# EAGLE design mainV2b (EAGLE 6.6.0)
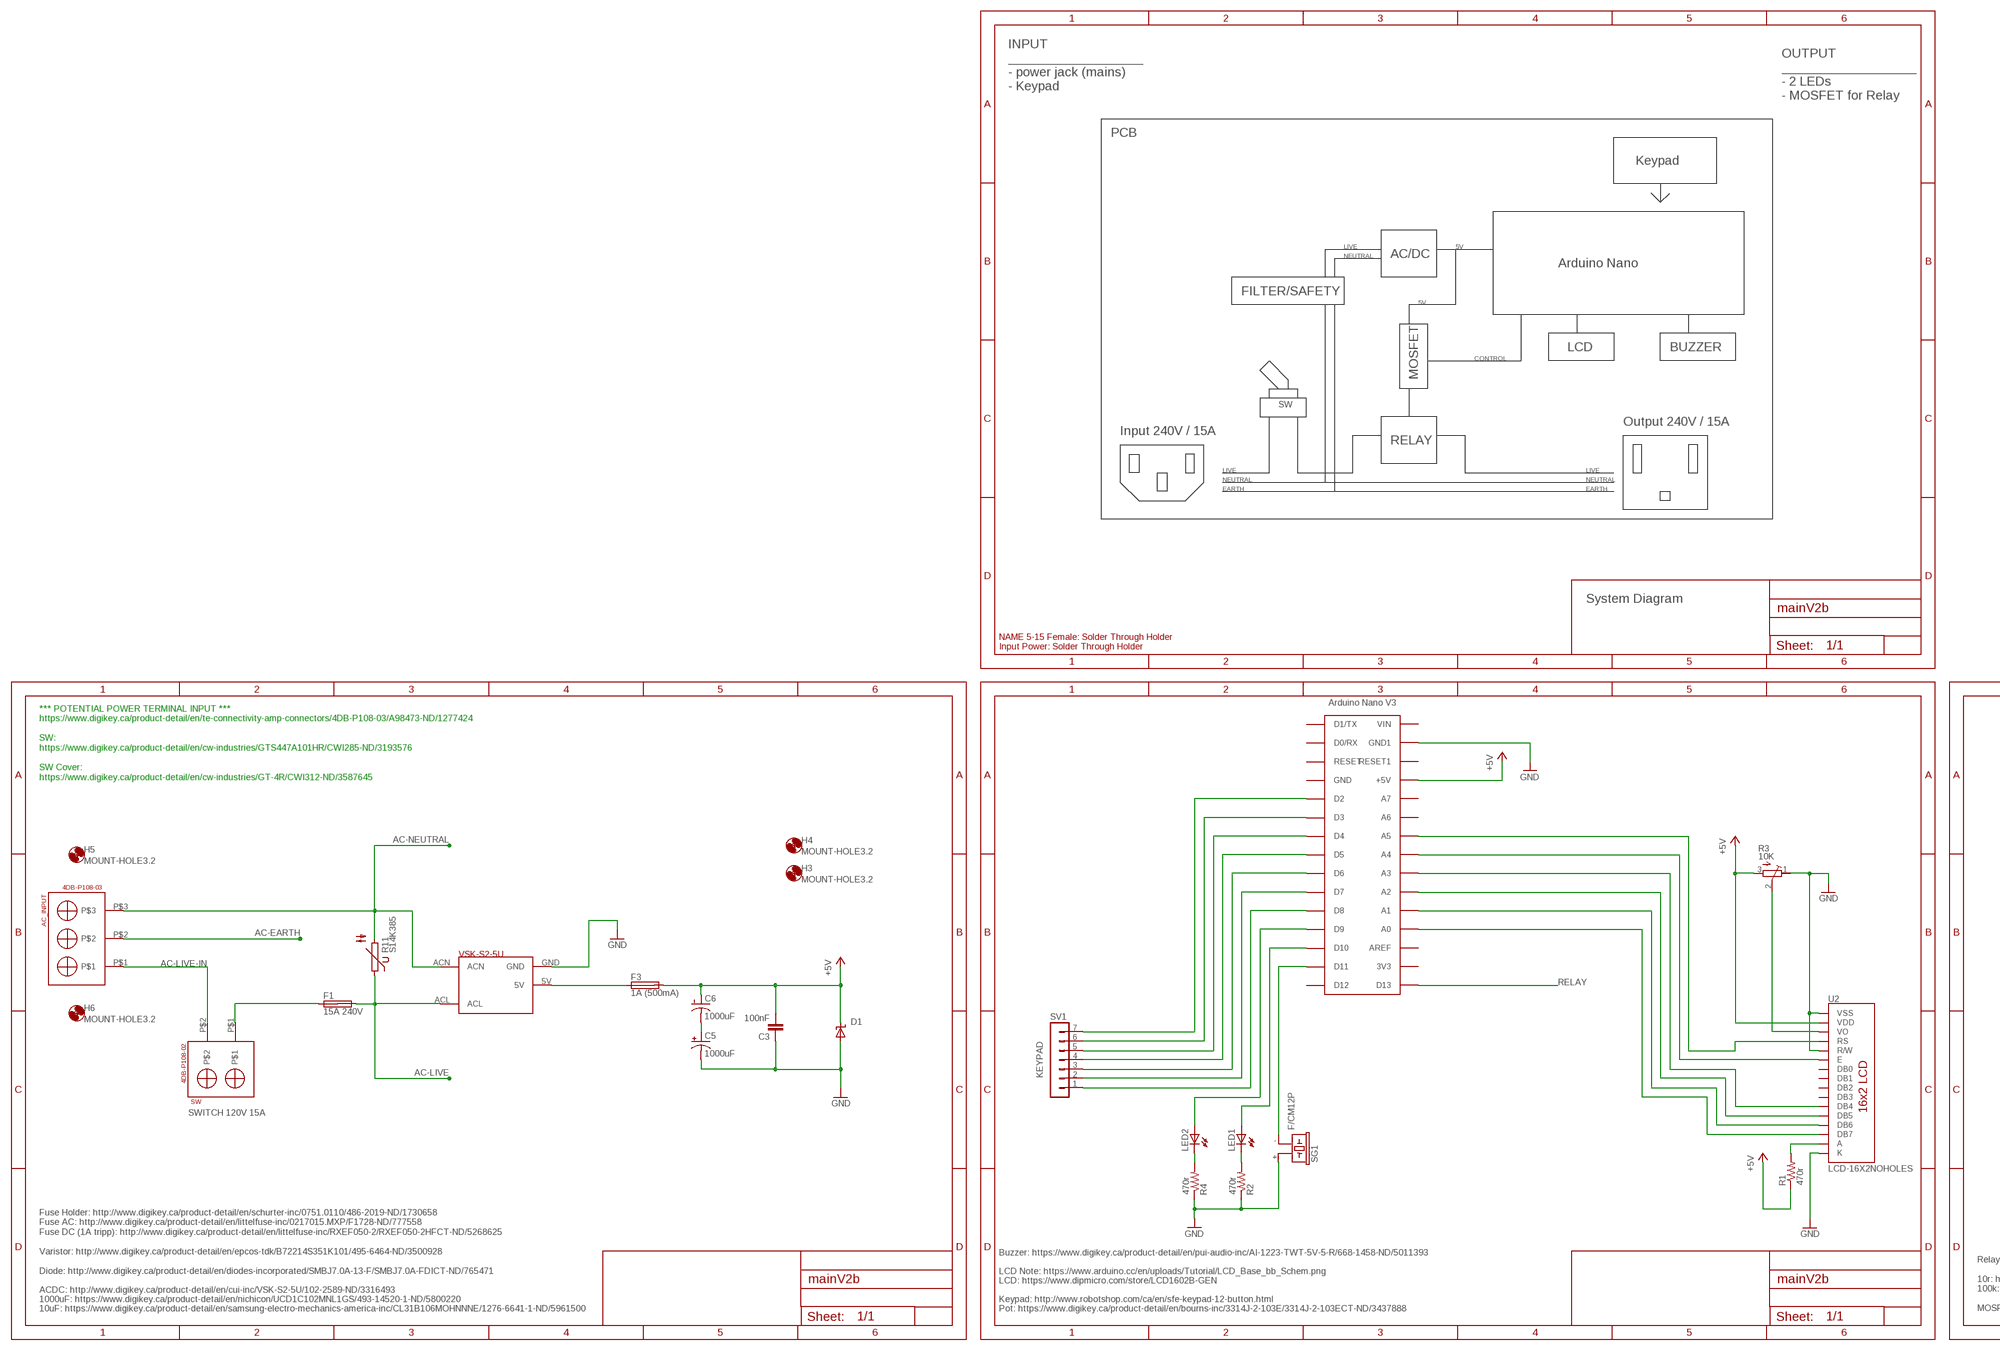
[diagram p0: schematic, sheet 1, part 1 of 2]
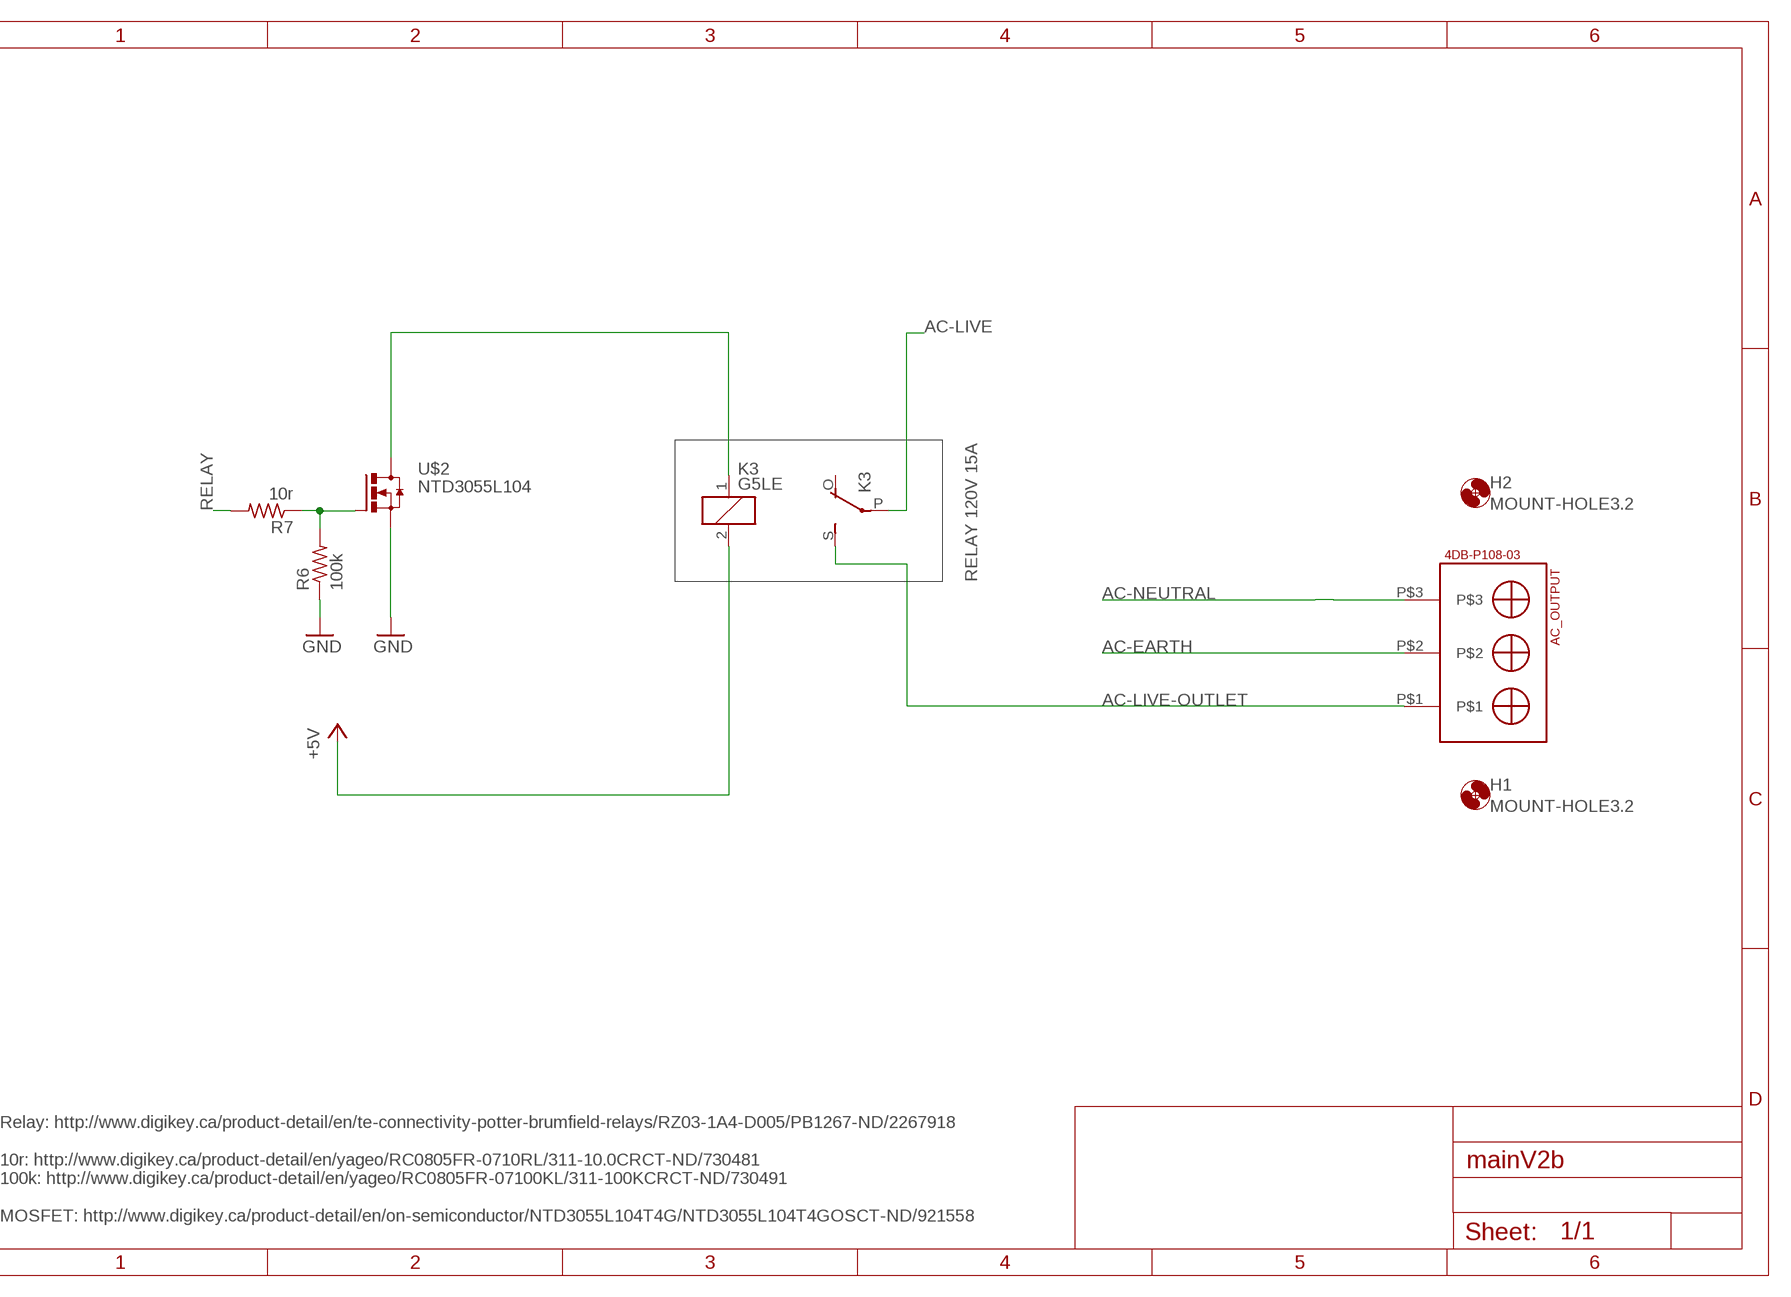
[diagram p1: schematic, sheet 1, part 2 of 2]

## Parts
AC_INPUT  4DB-P108-03  [4DB-P108-03]
AC_OUTPUT  4DB-P108-03  [4DB-P108-03]
C3  100nF  C-EUC1206  [C1206]
C5  1000uF  CPOL-USUD-10X10  [UD-10X10_NICHICON]
C6  1000uF  CPOL-USUD-10X10  [UD-10X10_NICHICON]
D1  SUPPRESSOR-SMBJ  [SMBJ]
F1  15A 240V  SHK20L  [SHK20L]
F3  1A (500mA)  TE5  [TE5]
H1  MOUNT-HOLE3.2  [3,2]
H2  MOUNT-HOLE3.2  [3,2]
H3  MOUNT-HOLE3.2  [3,2]
H4  MOUNT-HOLE3.2  [3,2]
H5  MOUNT-HOLE3.2  [3,2]
H6  MOUNT-HOLE3.2  [3,2]
K3  G5LE  [G5LE]
LED1  LEDCHIPLED_1206  [CHIPLED_1206]
LED2  LEDCHIPLED_1206  [CHIPLED_1206]
R1  470r  R-US_M2012  [M2012]
R2  470r  R-US_M2012  [M2012]
R3  10K  R-TRIMM3314G  [RTRIM3314G]
R4  470r  R-US_M2012  [M2012]
R6  100k  R-US_M2012  [M2012]
R7  10r  R-US_M2012  [M2012]
R11  S14K385  [S14K385]
SG1  F/CM12P  [F/CM12P]
SV1  MA07-1  [MA07-1]
SW  4DB-P108-02  [4DB-P108-02]
U2  LCD-16X2NOHOLES  [LCD-16X2_NOHOLESNOSILK]
U$1  ARDUINONANO  [PDIP-32]
U$2  NTD3055L104  [NTDV3055L104]
U$4  VSK-2S-5U  [VSK-S2-5U]

## Nets
+5V: C3.2 C6.+ D1.C F3.2 K3.2 R1.1 R3.3(A) U2.2(VDD) U$1.+5V
AC-EARTH: AC_INPUT.P$2 AC_OUTPUT.P$2
AC-LIVE: F1.2A K3.P(2:P) R11.1 U$4.ACL
AC-LIVE-IN: AC_INPUT.P$1 SW.P$2
AC-LIVE-OUTLET: AC_OUTPUT.P$1 K3.S(2:S)
AC-NEUTRAL: AC_INPUT.P$3 AC_OUTPUT.P$3 R11.2 U$4.ACN
GND: C3.1 C5.- D1.A R2.1 R3.1(E) R4.1 R6.1 SG1.+ U2.1(VSS) U2.5(R/W) U2.16(K) U$1.GND1 U$2.3(S) U$4.GND
N$1: U2.4(RS) U$1.A2(A5)
N$2: U2.6(E) U$1.A3(A4)
N$3: U2.11(DB4) U$1.A4(A3)
N$4: U2.12(DB5) U$1.A5(A2)
N$5: U2.13(DB6) U$1.A6(A1)
N$6: R6.2 R7.1 U$2.1(G)
N$7: U2.14(DB7) U$1.A7(A0)
N$8: K3.1 U$2.4(D)
N$9: R3.2(S) U2.3(VO)
N$10: R1.2 U2.15(A)
N$12: F1.1A SW.P$1
N$16: SV1.1 U$1.D8
N$17: SV1.2 U$1.D7
N$18: SV1.3 U$1.D6
N$19: SV1.4 U$1.D5
N$20: SV1.5 U$1.D4
N$21: C5.+ C6.-
N$22: F3.1 U$4.5V
N$23: SV1.6 U$1.D3
N$24: SV1.7 U$1.D2
N$26: LED1.C R2.2
N$27: LED2.C R4.2
N$28: LED2.A U$1.D9
N$29: LED1.A U$1.D10
N$30: SG1.- U$1.D11
RELAY: R7.2 U$1.D13
Unconnected: F1.1B F1.2B K3.O(2:O) U2.7(DB0) U2.8(DB1) U2.9(DB2) U2.10(DB3) U$1.3V3 U$1.A0(A7) U$1.A1(A6) U$1.AREF U$1.D0/RX U$1.D1/TX U$1.D12 U$1.GND U$1.RESET U$1.RESET1 U$1.VIN

## Notes on the sheet
- INPUT
  __________________
  - power jack (mains)
  - Keypad
- OUTPUT
  __________________
  - 2 LEDs
  - MOSFET for Relay
- PCB
- Keypad
- LIVE | 5V
- NEUTRAL | AC/DC
- Arduino Nano
- FILTER/SAFETY
- 5V
- LCD | BUZZER
- CONTROL
- MOSFET
- SW
- Output 240V / 15A
- Input 240V / 15A
- RELAY
- LIVE | LIVE
- NEUTRAL | NEUTRAL
- EARTH | EARTH
- System Diagram
- NAME 5-15 Female: Solder Through Holder
  Input Power: Solder Through Holder
- *** POTENTIAL POWER TERMINAL INPUT ***
  https://www.digikey.ca/product-detail/en/te-connectivity-amp-connectors/4DB-P108-03/A98473-ND/1277424
  
  SW:
  https://www.digikey.ca/product-detail/en/cw-industries/GTS447A101HR/CWI285-ND/3193576
  
  SW Cover:
  https://www.digikey.ca/product-detail/en/cw-industries/GT-4R/CWI312-ND/3587645
- RELAY 120V 15A
- KEYPAD
- SWITCH 120V 15A
- Buzzer: https://www.digikey.ca/product-detail/en/pui-audio-inc/AI-1223-TWT-5V-5-R/668-1458-ND/5011393
- Fuse Holder: http://www.digikey.ca/product-detail/en/schurter-inc/0751.0110/486-2019-ND/1730658
  Fuse AC: http://www.digikey.ca/product-detail/en/littelfuse-inc/0217015.MXP/F1728-ND/777558
  Fuse DC (1A tripp): http://www.digikey.ca/product-detail/en/littelfuse-inc/RXEF050-2/RXEF050-2HFCT-ND/5268625
  
  Varistor: http://www.digikey.ca/product-detail/en/epcos-tdk/B72214S351K101/495-6464-ND/3500928
  
  Diode: http://www.digikey.ca/product-detail/en/diodes-incorporated/SMBJ7.0A-13-F/SMBJ7.0A-FDICT-ND/765471
- LCD Note: https://www.arduino.cc/en/uploads/Tutorial/LCD_Base_bb_Schem.png
- LCD: https://www.dipmicro.com/store/LCD1602B-GEN
- ACDC: http://www.digikey.ca/product-detail/en/cui-inc/VSK-S2-5U/102-2589-ND/3316493
- 1000uF: https://www.digikey.ca/product-detail/en/nichicon/UCD1C102MNL1GS/493-14520-1-ND/5800220 | Keypad: http://www.robotshop.com/ca/en/sfe-keypad-12-button.html
- 10uF: https://www.digikey.ca/product-detail/en/samsung-electro-mechanics-america-inc/CL31B106MOHNNNE/1276-6641-1-ND/5961500 | Pot: https://www.digikey.ca/product-detail/en/bourns-inc/3314J-2-103E/3314J-2-103ECT-ND/3437888
- Relay: http://www.digikey.ca/product-detail/en/te-connectivity-potter-brumfield-relays/RZ03-1A4-D005/PB1267-ND/2267918
  
  10r: http://www.digikey.ca/product-detail/en/yageo/RC0805FR-0710RL/311-10.0CRCT-ND/730481
  100k: http://www.digikey.ca/product-detail/en/yageo/RC0805FR-07100KL/311-100KCRCT-ND/730491
  
  MOSFET: http://www.digikey.ca/product-detail/en/on-semiconductor/NTD3055L104T4G/NTD3055L104T4GOSCT-ND/921558

## Library data of the parts
AC_INPUT AC_OUTPUT = outletControl:4DB-P108-03
C3 = rcl:C-EU: CAPACITOR, European symbol
C5 C6 = rcl:CPOL-US: POLARIZED CAPACITOR, American symbol
D1 = diode:SUPPRESSOR-: Suppressor diode
F1 = fuse:SHK20L: FUSE HOLDER 5 x 20 mm, SH contact, SHH1 Schukat, E1073 Buerklin; OC_FARNELL: unknown; OC_NEWARK: unknown
F3 = fuse:TE5: FUSE Wickmann; OC_FARNELL: unknown; OC_NEWARK: unknown
H1-H6 = holes:MOUNT-HOLE: MOUNTING HOLE with drill center marker
K3 = relay:G5LE: RELAY 1 x switch, 10 A/120 V AC, 8 A/30 V DC, Omron; OC_FARNELL: unknown; OC_NEWARK: unknown
LED1 LED2 = led:LED: LED OSRAM: - CHIPLED LG R971, LG N971, LY N971, LG Q971, LY Q971, LO R971, LY R971 LH N974, LH R974 LS Q976, LO Q976, LY Q976 LO Q996 - Hyper CHIPLED LW Q18S LB Q993, LB Q99A, LB R99A - SideLED LS A670, LO A670, LY A670, LG A670, LP A670 LB A673, LV A673, LT A673, LW A673 LH A674 LY A675 LS A676, LA A676, LO A676, LY A676, LW A676 LS A679, LY A679, LG A679 - Hyper Micro SIDELED® LS Y876, LA Y876, LO Y876, LY Y876 LT Y87S - SmartLED LW L88C, LW L88S LB L89C, LB L89S, LG L890 LS L89K, LO L89K, LY L89K LS L896, LA L896, LO L896, LY L896 - TOPLED LS T670, LO T670, LY T670, LG T670, LP T670 LSG T670, LSP T670, LSY T670, LOP T670, LYG T670 LG T671, LOG T671, LSG T671 LB T673, LV T673, LT T673, LW T673 LH T674 LS T676, LA T676, LO T676, LY T676, LB T676, LH T676, LSB T676, LW T676 LB T67C, LV T67C, LT T67C, LS T67K, LO T67K, LY T67K, LW E67C LS E67B, LA E67B, LO E67B, LY E67B, LB E67C, LV E67C, LT E67C LW T67C LS T679, LY T679, LG T679 LS T770, LO T770, LY T770, LG T770, LP T770 LB T773, LV T773, LT T773, LW T773 LH T774 LS E675, LA E675, LY E675, LS T675 LS T776, LA T776, LO T776, LY T776, LB T776 LHGB T686 LT T68C, LB T68C - Hyper Mini TOPLED® LB M676 - Mini TOPLED Santana® LG M470 LS M47K, LO M47K, LY M47K Source: http://www.osram.convergy.de LUXEON: - LUMILED® LXK2-PW12-R00, LXK2-PW12-S00, LXK2-PW14-U00, LXK2-PW14-V00 LXK2-PM12-R00, LXK2-PM12-S00, LXK2-PM14-U00 LXK2-PE12-Q00, LXK2-PE12-R00, LXK2-PE12-S00, LXK2-PE14-T00, LXK2-PE14-U00 LXK2-PB12-K00, LXK2-PB12-L00, LXK2-PB12-M00, LXK2-PB14-N00, LXK2-PB14-P00, LXK2-PB14-Q00 LXK2-PR12-L00, LXK2-PR12-M00, LXK2-PR14-Q00, LXK2-PR14-R00 LXK2-PD12-Q00, LXK2-PD12-R00, LXK2-PD12-S00 LXK2-PH12-R00, LXK2-PH12-S00 LXK2-PL12-P00, LXK2-PL12-Q00, LXK2-PL12-R00 Source: www.luxeon.com KINGBRIGHT: KA-3528ASYC Source: www.kingbright.com
R1 R2 R4 R6 R7 = rcl:R-US_: RESISTOR, American symbol
R3 = resistor:R-TRIMM: Trimm resistor
R11 = varistor:S14K385: VARISTOR
SG1 = buzzer:F/CM12P: BUZZER Source: Buerklin; OC_FARNELL: unknown; OC_NEWARK: unknown
SV1 = con-lstb:MA07-1: PIN HEADER; OC_FARNELL: unknown; OC_NEWARK: unknown
SW = outletControl:4DB-P108-02
U2 = SparkFun-Displays:LCD-16X2: Standard text-only 16x2 parallel input LCD Basic 16 character by 2 line display. Typically utilizes the extremely common HD44780 parallel interface chipset SparkFun Products: Basic 16x2 Green <https://www.sparkfun.com/products/255> Basic 8x2 Green <https://www.sparkfun.com/products/11122>; SF_ID: LCD-00255
U$1 = CRE-Lib1:ARDUINONANO: Arduino Nano
U$2 = Smartiphy:NTD3055L104
U$4 = lletek:VSK-2S-5U

## Net classes
0 default: width 0.178 mm, drill 0.381 mm, clearance 0.178 mm

## Board
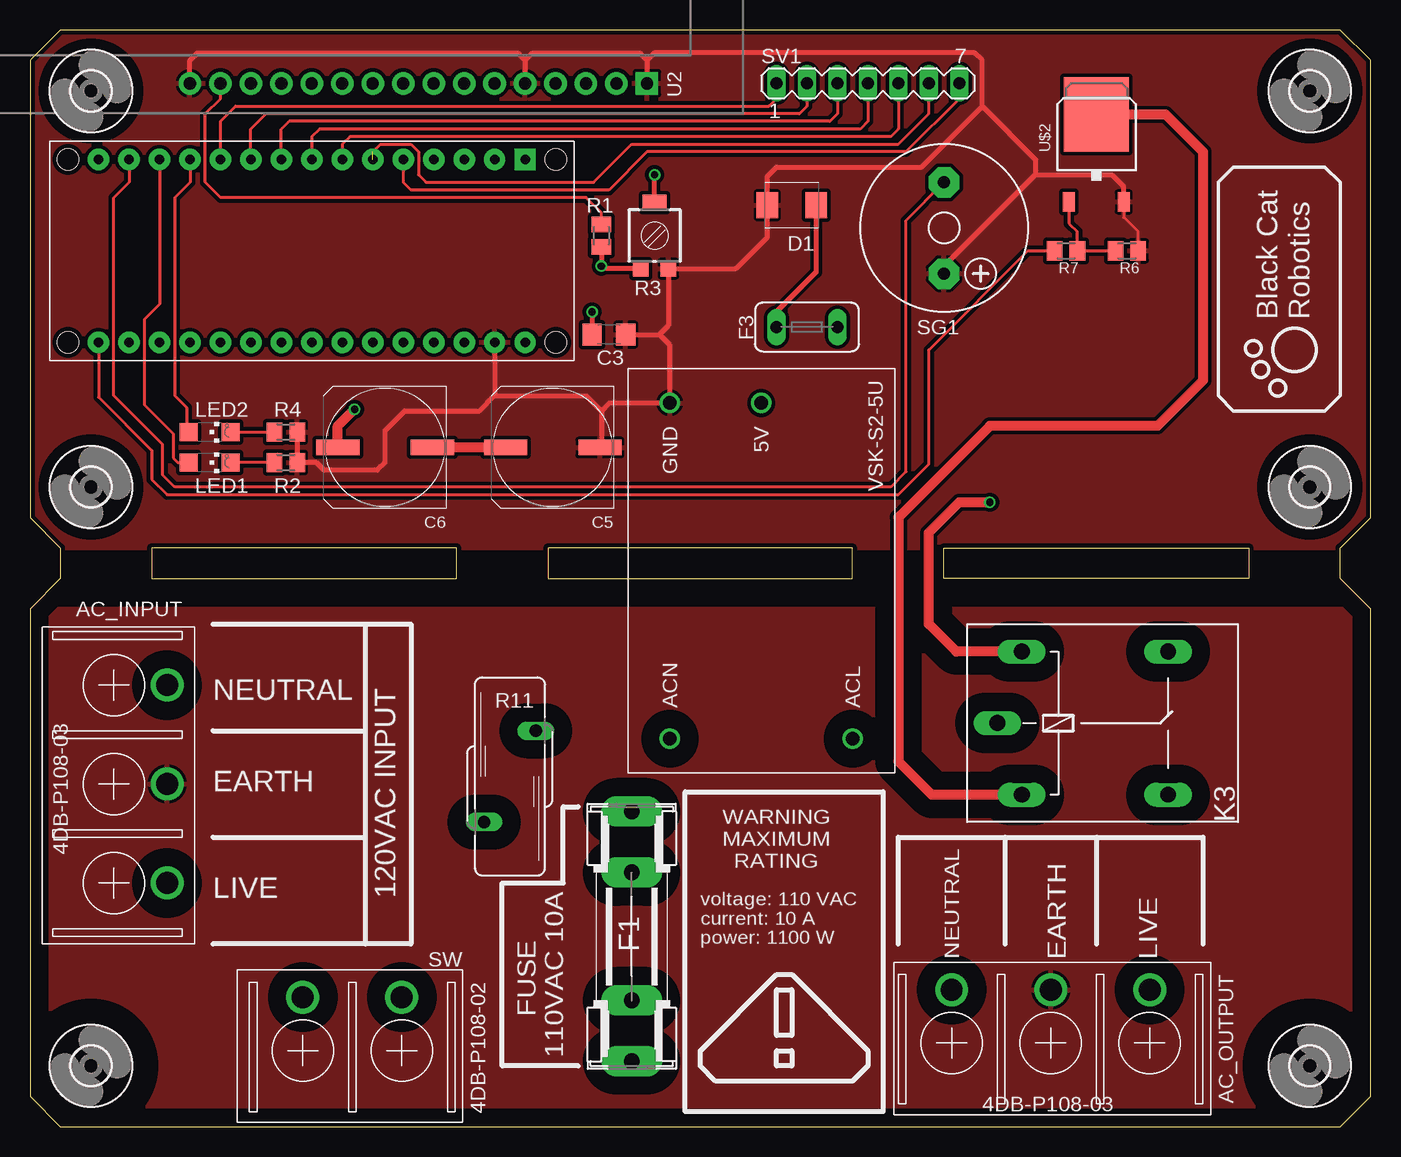
[diagram p2: board, top side]
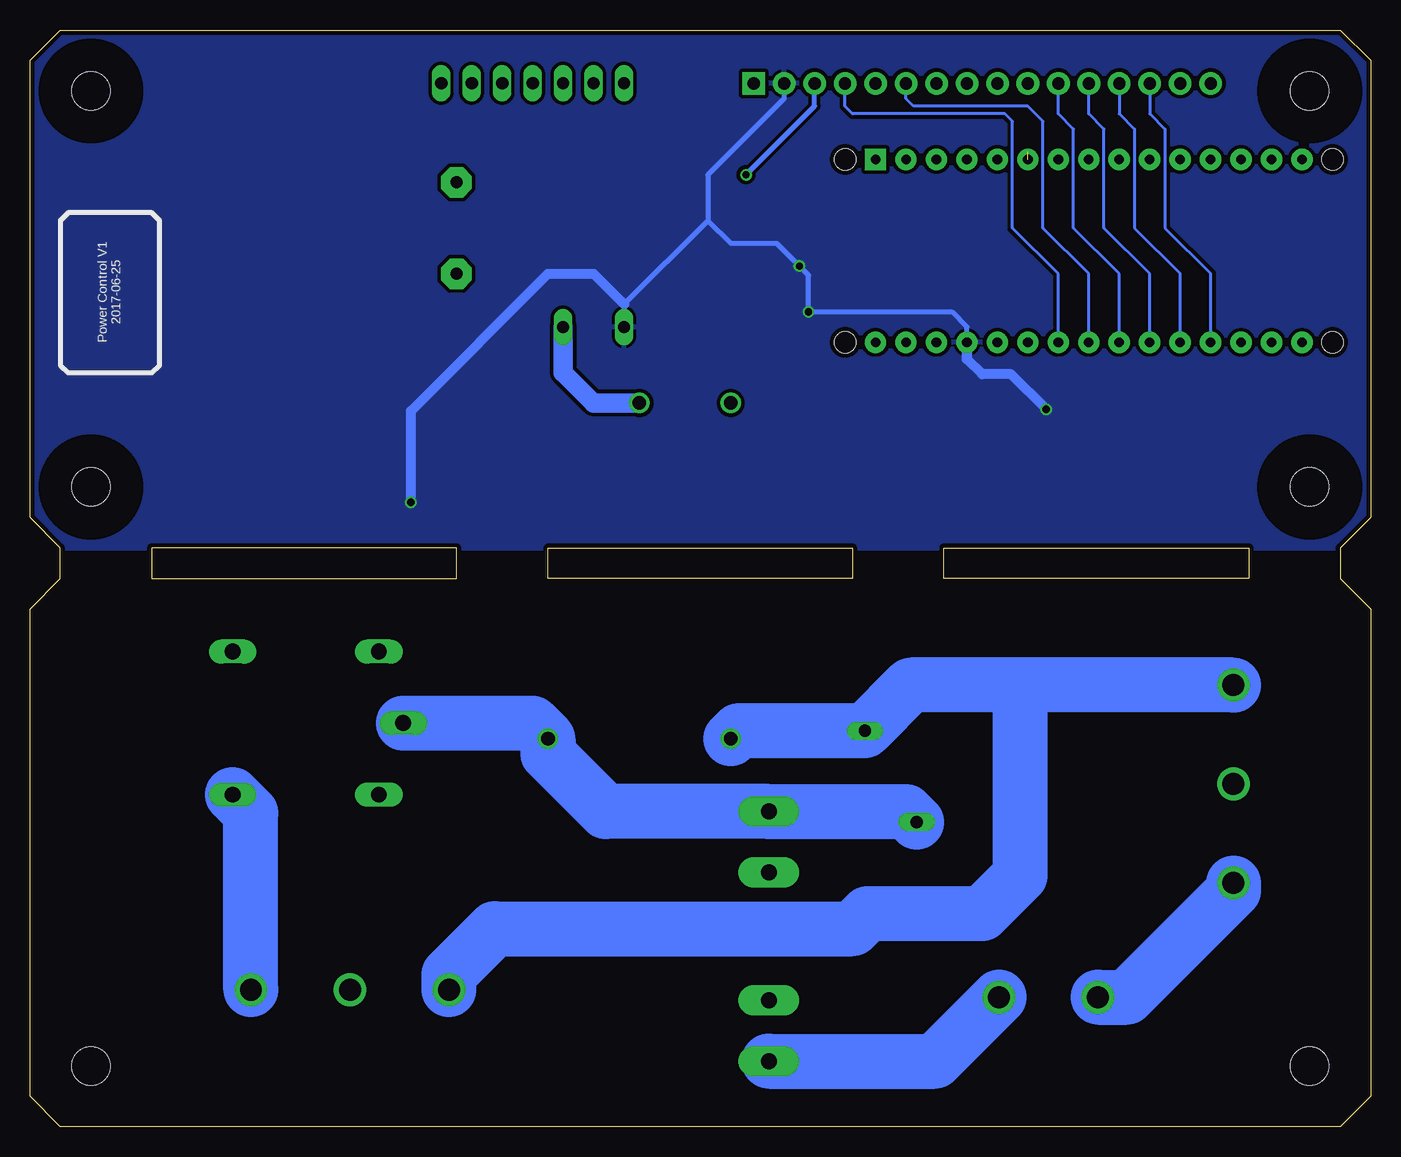
[diagram p3: board, bottom side, seen from below]

Size 111.76 x 91.44 mm. Coordinates in mm from the lower left corner, seen from the top.
Outline: 2.54,0 109.22,0 111.76,2.54 111.76,43.18 109.22,45.72 109.22,48.26 111.76,50.8 111.76,88.9 109.22,91.44 2.54,91.44 0,88.9 0,50.8 2.54,48.26 2.54,45.72 0,43.18 0,2.54 2.54,0
Outline: 10.16,48.26 10.16,45.72 35.56,45.72 35.56,48.26 10.16,48.26
Outline: 43.18,48.26 43.18,45.72 68.58,45.72 68.58,48.26 43.18,48.26
Outline: 101.6,48.26 101.6,45.72 76.2,45.72 76.2,48.26 101.6,48.26
Copper layers (1*16): Top 0.0356mm / dielectric 1.5011mm / Bottom 0.0356mm
Design rules "OSHpark": minimum track width 6mil, minimum drill 13mil, track to track 6mil, track to pad 6mil, pad to pad 6mil, via to via 6mil, smd to smd 6mil, copper to edge 15mil, drill to drill 6mil, minimum pad ring 7mil, minimum via ring 7mil, stop-mask expansion 3mil, vias tented up to drill 0mil, thermal gap 10mil

### Footprints (pad centres in the part's own frame; a part is rotated, then mirrored left to right if it is on the bottom)
4DB-P108-03 = drill 1.829: P$1 0,0; P$2 8.255,0; P$3 16.51,0
C1206 = smd 1.6 x 1.8: 1 -1.4,0; 2 1.4,0
UD-10X10_NICHICON = smd 3.6 x 1.3: + 3.925,0; - -3.95,0
SMBJ = smd 1.78 x 2.16: A 2.04,0; C -2.03,0
SHK20L = drill 1.321 pad 2.54 long: 1A -10.414,0; 1B -5.334,0; 2A 10.414,0; 2B 5.334,0
TE5 = drill 1.016 long: 1 -2.54,0; 2 2.54,0
3,2 = hole 3.2: 0,0
G5LE = drill 1.321 long: 1 -7.493,-5.969; 2 -7.493,5.969; O 4.699,5.969; P -9.525,0; S 4.699,-5.969
CHIPLED_1206 = smd 1.5 x 1.5: A 0,-1.75; C 0,1.75
M2012 = smd 1.3 x 1.6: 1 -0.95,0; 2 0.95,0
RTRIM3314G = smd 1.3 x 1.3: 1 1.15,-2.75; 3 -1.15,-2.75 | smd 2 x 1.3: 2 0,2.75
S14K385 = drill 1.016 long: 1 -2.159,-3.81; 2 2.159,3.81
F/CM12P = drill 1.016 pad 2.54 octagon: + 3.81,0; - -3.81,0
MA07-1 = drill 1.016 long: 1 -7.62,0; 2 -5.08,0; 3 -2.54,0; 4 0,0; 5 2.54,0; 6 5.08,0; 7 7.62,0
4DB-P108-02 = drill 1.829: P$1 -7.62,-5.08; P$2 0.635,-5.08
LCD-16X2_NOHOLESNOSILK = drill 1.016 pad 1.88 square: 1 -32,15.5 | drill 1.016 pad 1.88: 2 -29.46,15.5; 3 -26.92,15.5; 4 -24.38,15.5; 5 -21.84,15.5; 6 -19.3,15.5; 7 -16.76,15.5; 8 -14.22,15.5; 9 -11.68,15.5; 10 -9.14,15.5; 11 -6.6,15.5; 12 -4.06,15.5; 13 -1.52,15.5; 14 1.02,15.5; 15 3.56,15.5; 16 6.1,15.5
PDIP-32 = drill 0.8 pad 1.778: 3V3 15.24,-35.56; +5V 15.24,-10.16; A0 15.24,-12.7; A1 15.24,-15.24; A2 15.24,-17.78; A3 15.24,-20.32; A4 15.24,-22.86; A5 15.24,-25.4; A6 15.24,-27.94; A7 15.24,-30.48; AREF 15.24,-33.02; D0/RX 0,-5.08; D2 0,-12.7; D3 0,-15.24; D4 0,-17.78; D5 0,-20.32; D6 0,-22.86; D7 0,-25.4; D8 0,-27.94; D9 0,-30.48; D10 0,-33.02; D11 0,-35.56; D12 0,-38.1; D13 15.24,-38.1; GND 0,-10.16; GND1 15.24,-5.08; RESET 0,-7.62; RESET1 15.24,-7.62; VIN 15.24,-2.54 | drill 0.8 pad 1.778 square: D1/TX 0,-2.54 | hole 1.778: 0,0; 0,-40.64; 15.24,-40.64; 15.24,0
NTDV3055L104 = smd 1 x 1.6: 1 -2.28,-6.07; 3 2.28,-6.07 | smd 5.4 x 6.2: 4 0,1.23
VSK-S2-5U = drill 1.143: 5V 13.995,0; ACL -13.995,-7.62; ACN -13.995,7.62; GND 13.995,7.62

### Placement (x,y rotation side)
AC_INPUT  11.43,20.32 90 top
AC_OUTPUT  93.34,11.43 180 top
C3  48.26,66.04 180 top
C5  43.56,56.64 180 top
C6  29.59,56.64 180 top
D1  63.5,76.83 180 top
F1  50.16,15.88 90 top
F3  64.77,66.67 180 top
H1  5.08,86.36 0 top
H2  106.68,5.08 0 top
H3  106.68,86.36 0 top
H4  5.08,5.08 0 top
H5  5.08,53.34 0 top
H6  106.68,53.34 0 top
K3  90.17,33.66 0 top
LED1  14.99,55.37 270 top
LED2  14.99,57.91 270 top
R1  47.62,74.3 90 top
R2  21.34,55.37 180 top
R3  52.07,74.3 0 top
R4  21.34,57.91 180 top
R6  91.44,73.03 180 top
R7  86.36,73.03 180 top
R11  40.01,29.21 0 top
SG1  76.2,74.93 270 top
SV1  69.85,87 0 top
SW  23.37,5.71 180 top
U2  19.43,102.49 180 top
U$1  43.81,80.64 270 top
U$2  88.9,83.19 0 top
U$4  60.96,46.35 90 top

### Tracks (layer width: path | path; a pad name or v marks a point on that pad's centre or on a via)
+5V  (via drill 0.6)
  Top 0.406: R1.1 v47.62,71.75 47.84,71.55 R3.3 | D1.C 65.53,71.25 62.23,67.94 F3.2 | v46.86,67.94 C3.2
  Top 0.813: C6.+ 25.67,58.43 v27.05,59.82 | K3.2 77.22,39.62 74.93,41.91 74.93,49.53 77.47,52.07 v80.01,52.07
  Bottom 0.406: U2.2 48.89,85.73 55.24,79.38 55.24,75.56 | 55.24,75.56 53.34,73.66 49.53,73.66 v47.62,71.75 46.86,70.99 v46.86,67.94 34.92,67.94 33.66,66.67 U$1.+5V | 55.24,75.56 62.23,68.58 F3.2
  Bottom 0.813: v27.05,59.82 29.97,62.74 32.38,62.74 33.66,64.01 | v80.01,52.07 80.01,59.69 68.58,71.12 64.77,71.12 62.23,68.58
  Bottom 0.864: 33.66,64.01 U$1.+5V
  pour Bottom (isolate 0.305): 0,50.8 0,88.9 2.54,91.44 109.22,91.44 111.76,88.9 111.76,50.8 109.22,48.26 2.54,48.26
AC-EARTH
  pour Top (isolate 1.524): 0,43.18 111.76,43.18 111.76,2.54 109.22,0 2.54,0 0,2.54
AC-LIVE
  Bottom 4.572: R11.1 38.73,26.29 F1.2A 63.78,26.29 68.58,31.09 U$4.ACL 69.88,33.66 K3.P
AC-LIVE-IN
  Bottom 4.572: AC_INPUT.P$1 11.43,19.68 20.32,10.79 SW.P$2
AC-LIVE-OUTLET
  Bottom 4.572: AC_OUTPUT.P$1 93.34,26.16 K3.S
AC-NEUTRAL
  Bottom 4.572: AC_INPUT.P$3 29.21,36.83 | 29.21,36.83 38.35,36.83 R11.2 52.68,33.02 U$4.ACN | 29.21,36.83 29.21,20.95 32.38,17.78 41.91,17.78 43.18,16.51 73.03,16.51 76.83,12.7 AC_OUTPUT.P$3
GND
  Top 0.254: U$2.3 91.18,75.83 92.39,74.61 R6.1
  Top 0.406: U2.16 13.33,88.9 13.97,89.53 40.64,89.53 41.27,88.9 U2.5 41.27,88.9 41.91,89.53 50.8,89.53 51.44,88.9 | 51.44,88.9 U2.1 | SG1.+ 76.2,71.75 83.82,79.38 | 83.82,79.38 90.17,79.38 91.18,78.36 U$2.3 | R4.1 R2.1 23.88,55.37 24.51,54.74 28.96,54.74 29.59,55.37 29.59,58.04 31.24,59.69 37.47,59.69 38.73,60.96 | 79.38,85.09 74.3,80.01 62.23,80.01 61.46,79.24 D1.A 61.46,74.16 58.84,71.55 R3.1 53.22,66.8 52.47,66.04 | 79.38,85.09 79.38,88.9 78.74,89.53 52.07,89.53 51.44,88.9 | 79.38,85.09 83.82,80.64 83.82,79.38 | 47.62,59.69 48.28,60.35 U$4.GND 53.34,65.17 52.47,66.04 | 47.62,59.69 47.62,56.76 C5.- | 38.73,60.96 46.35,60.96 47.62,59.69 | C3.1 52.47,66.04 | U$1.GND1 38.73,60.96
  pour Top (isolate 0.305): 0,88.9 2.54,91.44 109.22,91.44 111.76,88.9 111.76,50.8 109.22,48.26 2.54,48.26 0,50.8
N$1
  Bottom 0.254: U2.4 43.81,85.09 43.18,84.45 30.48,84.45 29.84,83.82 29.84,74.93 26.04,71.12 U$1.A2
N$2
  Bottom 0.254: U2.6 38.73,85.72 38.1,85.09 28.57,85.09 27.3,83.82 27.3,74.93 23.5,71.12 U$1.A3
N$3
  Bottom 0.254: U2.11 26.04,84.45 24.77,83.19 24.77,74.93 20.95,71.12 U$1.A4
N$4
  Bottom 0.254: U2.12 23.5,84.45 22.23,83.19 22.23,74.93 18.41,71.12 U$1.A5
N$5
  Bottom 0.254: U2.13 20.95,84.45 19.68,83.19 19.68,74.93 15.88,71.12 U$1.A6
N$6
  Top 0.254: R6.2 R7.1 87.31,74.61 86.62,75.31 U$2.1
N$7
  Bottom 0.254: U2.14 18.41,84.45 17.14,83.19 17.14,74.93 13.34,71.12 U$1.A7
N$8
  Top 0.813: U$2.4 94.66,84.42 97.79,81.28 97.79,62.23 93.98,58.42 80.01,58.42 72.39,50.8 72.39,30.48 75.18,27.69 K3.1
N$9  (via drill 0.6)
  Top 0.406: R3.2 v52.07,79.38
  Bottom 0.406: v52.07,79.38 46.35,85.09 U2.3
N$10
  Top 0.254: R1.2 47.62,76.2 46.35,77.47 15.88,77.47 14.61,78.74 14.61,84.45 15.88,85.72 U2.15
N$12
  Bottom 4.572: F1.1A 36.32,5.46 SW.P$1
N$16
  Top 0.254: SV1.1 62.23,85.72 61.59,85.09 17.14,85.09 15.88,83.82 U$1.D8
N$17
  Top 0.254: SV1.2 64.77,85.09 64.14,84.45 19.68,84.45 18.41,83.19 U$1.D7
N$18
  Top 0.254: SV1.3 67.31,84.45 66.67,83.82 21.59,83.82 20.95,83.19 U$1.D6
N$19
  Top 0.254: SV1.4 69.85,83.82 69.22,83.19 24.13,83.19 23.5,82.55 U$1.D5
N$20
  Top 0.254: SV1.5 72.39,83.19 71.75,82.55 26.67,82.55 26.04,81.92 U$1.D4
N$21
  Top 0.813: C5.+ C6.-
N$22
  Bottom 1.626: F3.1 67.31,62.89 64.77,60.35 U$4.5V
N$23  (1 unrouted)
  Top 0.254: SV1.6 74.93,84.45 72.39,81.92 50.16,81.92 46.99,78.74 33.02,78.74 32.38,79.38 32.38,81.28 31.75,81.92 29.21,81.92 28.57,81.28
N$24
  Top 0.254: SV1.7 77.47,85.72 73.03,81.28 51.44,81.28 48.26,78.11 31.75,78.11 31.11,78.74 U$1.D2
N$26
  Top 0.254: R2.2 LED1.C
N$27
  Top 0.254: LED2.C R4.2
N$28
  Top 0.254: 13.08,57.91 LED2.A 13.08,58.07 13.08,59.94 12.06,60.96 12.06,77.47 13.34,78.74 U$1.D9
N$29
  Top 0.254: 13.72,55.37 LED1.A | LED1.A 13.08,55.37 | LED1.A 12.32,55.37 11.94,55.75 11.94,57.78 9.53,60.2 9.53,67.31 10.79,68.58 U$1.D10
N$30
  Top 0.254: SG1.- 73.03,75.56 73.03,54.61 71.75,53.34 12.06,53.34 11.05,54.36 11.05,56.9 6.99,60.96 6.99,77.47 8.26,78.74 U$1.D11
RELAY
  Top 0.254: R7.2 83.19,73.03 74.93,64.77 74.93,55.24 72.39,52.7 11.43,52.7 10.16,53.98 10.16,56.39 5.71,60.83 U$1.D13

### Text on the board
tPlace: 120VAC INPUT | voltage: 110 VAC / current: 10 A / power: 1100 W
tNames: Black Cat / Robotics | NEUTRAL | EARTH | WARNING / MAXIMUM / RATING | LIVE | NEUTRAL | EARTH | LIVE | FUSE / 110VAC 10A
_tsilk: Power Control V1 / @lambertofmtl / 2016-08-16
_bsilk: Power Control V1 / 2017-06-25